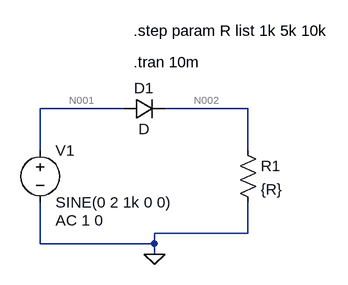
[diagram p0: schematic CL1_T4_Diodes.asc]
CL1_T4_Diodes.asc, the LTspice schematic file:
Version 4.1
SHEET 1 880 680
WIRE 208 80 80 80
WIRE 400 80 272 80
WIRE 80 144 80 80
WIRE 400 144 400 80
WIRE 400 272 400 224
WIRE 400 272 256 272
WIRE 80 288 80 224
WIRE 256 288 256 272
WIRE 256 288 80 288
WIRE 256 304 256 288
FLAG 256 304 0
SYMBOL voltage 80 128 R0
WINDOW 123 24 124 Left 2
WINDOW 39 0 0 Left 0
SYMATTR InstName V1
SYMATTR Value SINE(0 2 1k 0 0)
SYMATTR Value2 AC 1 0
SYMBOL diode 208 96 R270
WINDOW 0 32 32 VTop 2
WINDOW 3 0 32 VBottom 2
SYMATTR InstName D1
SYMBOL res 384 128 R0
SYMATTR InstName R1
SYMATTR Value {R}
TEXT 224 8 Left 2 !.tran 10m
TEXT 224 -40 Left 2 !.step param R list 1k 5k 10k

The netlist it stands for:
* CL1_T4_Diodes.asc
V1 N001 0 SINE(0 2 1k 0 0) AC 1 0
D1 N001 N002 D
R1 N002 0 {R}
.model D D
.lib standard.dio
.tran 10m
.step param R list 1k 5k 10k
.backanno
.end

* Results of the author's LTspice run, read from the files saved beside the schematic
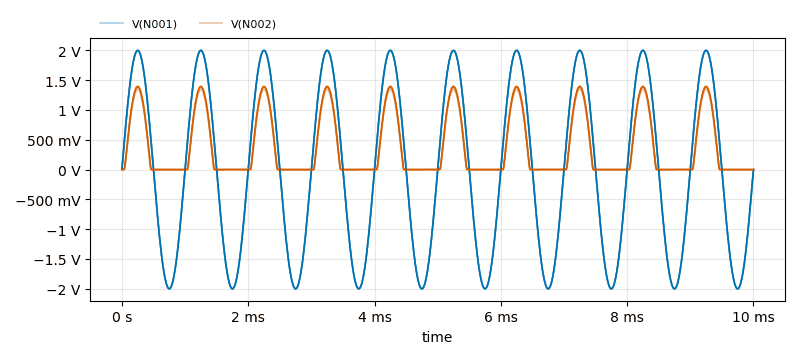
[diagram p1: Transient Analysis of CL1_T4_Diodes.asc, plotted from the saved traces]
* Transient Analysis, 3 runs:
*   V(N001) [r=1000]: min -2 V, max 2 V, average 0 V, rms 1.414 V, last 0 V
*   V(N001) [r=5000]: min -2 V, max 2 V, average 0 V, rms 1.414 V, last 0 V
*   V(N001) [r=10000]: min -2 V, max 2 V, average 0 V, rms 1.414 V, last 0 V
*   V(N002) [r=1000]: min 0 V, max 1.337 V, average 347.2 mV, rms 604.6 mV, last 0 V
*   V(N002) [r=5000]: min 0 V, max 1.378 V, average 363.5 mV, rms 627.9 mV, last 0 V
*   V(N002) [r=10000]: min 0 V, max 1.396 V, average 370.6 mV, rms 638 mV, last 0 V